# Altium schematic sheet flash.schdoc: FLASH
size A4; Date: 10.03.2026; CheckedBy: BCY; DrawnBy: miaow; Revision: v1.0.0; SheetNumber: 8; SheetTotal: 18; BoardType: MAIN_PCB; Desc: SPI nor-flash
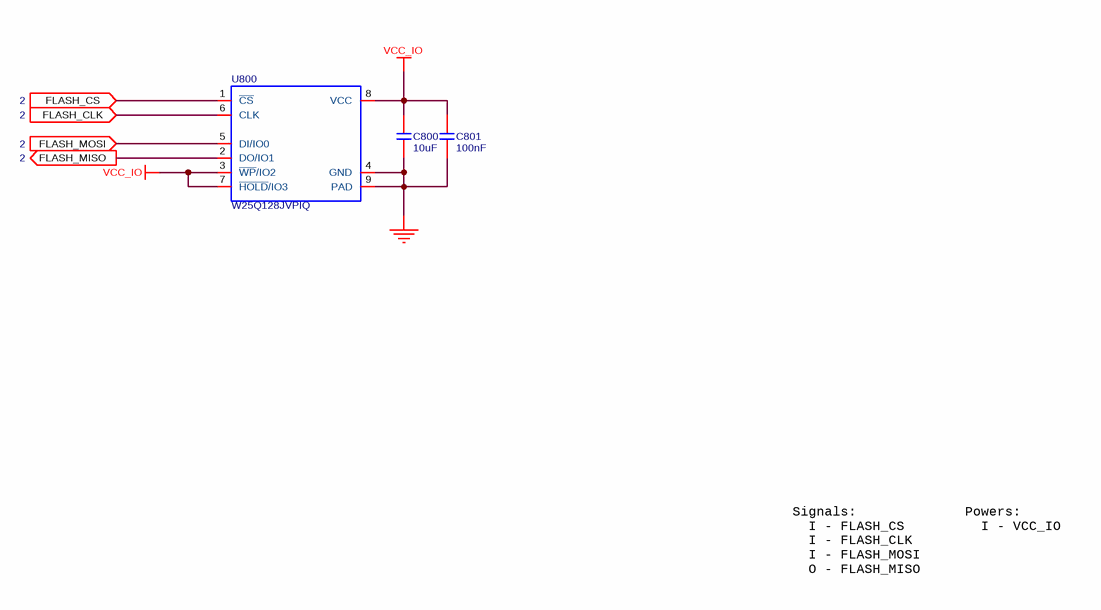
[diagram p0: flash.schdoc]

## Parts
C800  value 10uF  [C0402]  (hidden comment: C-NOMO)
C801  value 100nF  [C0402]  (hidden comment: C-NOMO)
U800  W25Q128JVPIQ  [W25Q128JVPIQ]

## Ports
FLASH_CLK (in, see 2), FLASH_CS (in, see 2), FLASH_MISO (out, see 2), FLASH_MOSI (in, see 2)

## Nets
GND: C800.2 C801.2 U800.4(GND) U800.9(PAD)
VCC_IO: C800.1 C801.1 U800.3(~{WP}/IO2) U800.7(~{HOLD}/IO3) U800.8(VCC)
FLASH_CLK: U800.6(CLK) ; port FLASH_CLK
FLASH_CS: U800.1(~{CS}) ; port FLASH_CS
FLASH_MISO: U800.2(DO/IO1) ; port FLASH_MISO
FLASH_MOSI: U800.5(DI/IO0) ; port FLASH_MOSI

## Notes on the sheet
- Signals:
  I - FLASH_CS
  I - FLASH_CLK
  I - FLASH_MOSI
  O - FLASH_MISO
- Powers:
  I - VCC_IO
- DRAWN
- CHECKED
- DRAWNBY
- SHEETS
- SHEETS_NO

## Library data of the parts
C800 = C-NOMO: voltage: 6.3V; precision: 20%; Supplier 1: LCSC; Supplier Part Number 1: C15525
C801 = C-NOMO: voltage: 50V; precision: 10%; Supplier 1: LCSC; Supplier Part Number 1: C307331
U800 = W25Q128JVPIQ: NOR FLASH; Supplier 1: LCSC; Supplier Part Number 1: C190862